# Altium schematic sheet usb2uart.SchDoc
size A4
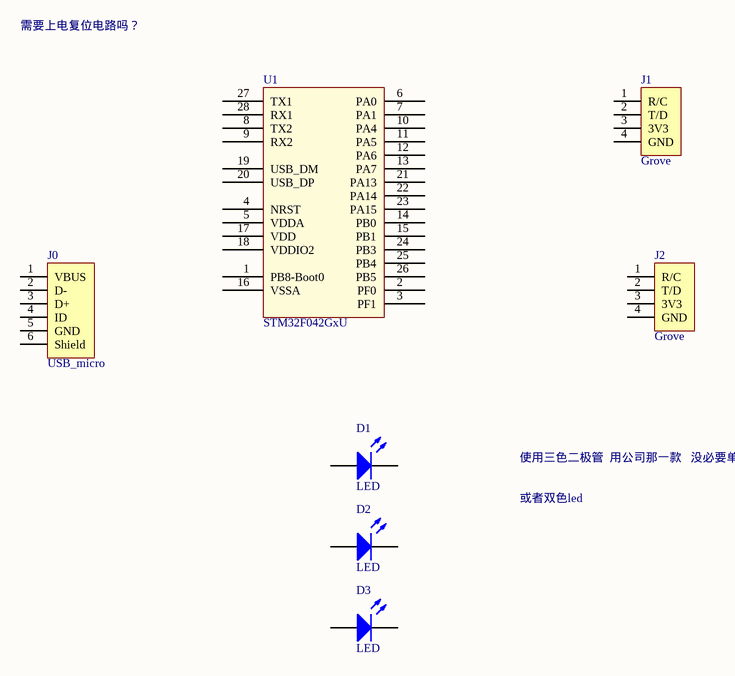
[diagram p0: usb2uart.SchDoc]

## Parts
D1  LED  [LED-1]
D2  LED  [LED-1]
D3  LED  [LED-1]
J0  USB_micro  [USB_MICRO]
J1  Grove  [S4B-PH-SM4]
J2  Grove  [S4B-PH-SM4]
U1  STM32F042GxU

## Nets

Not connected (* = marked no-connect by the designer): D1 1(A) 2(K); D2 1(A) 2(K); D3 1(A) 2(K); J0 1(VBUS) 2(D-) 3(D+) 4(ID) 5(GND) 6(Shield); J1 1(R/C) 2(T/D) 3(3V3) 4(GND); J2 1(R/C) 2(T/D) 3(3V3) 4(GND); U1 1(PB8-Boot0) 2(PF0) 3(PF1) 4(NRST) 5(VDDA) 6(PA0) 7(PA1) 8(TX2) 9(RX2) 10(PA4) 11(PA5) 12(PA6) 13(PA7) 14(PB0) 15(PB1) 16(VSSA) 17(VDD) 18(VDDIO2) 19(USB_DM) 20(USB_DP) 21(PA13) 22(PA14) 23(PA15) 24(PB3) 25(PB4) 26(PB5) 27(TX1) 28(RX1)

## Notes on the sheet
- 需要上电复位电路吗？
- 使用三色二极管  用公司那一款   没必要单独加电源指示灯
- 或者双色led

## Library data of the parts
D1-D3 = LED: Typical RED GaAs LED; Published: 8-Jun-2000; LatestRevisionDate: 08-Jul-2005; LatestRevisionNote: Mech Layer 1 removed.; PackageReference: LED-1; Publisher: Altium Limited; PackageDescription: LED; 2 Leads